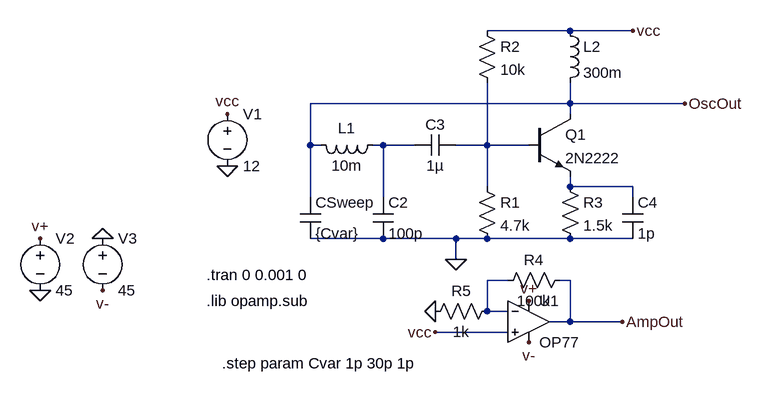
[diagram p0: schematic ColpittsOscilator2.asc]
ColpittsOscilator2.asc, the LTspice schematic file:
Version 4
SHEET 1 1280 784
WIRE 432 -32 304 -32
WIRE 528 -32 432 -32
WIRE 432 80 432 48
WIRE 432 80 32 80
WIRE 608 80 432 80
WIRE 432 96 432 80
WIRE 32 144 32 80
WIRE 48 144 32 144
WIRE 144 144 128 144
WIRE 192 144 144 144
WIRE 304 144 304 48
WIRE 304 144 256 144
WIRE 368 144 304 144
WIRE 304 208 304 144
WIRE 432 208 432 192
WIRE 528 208 432 208
WIRE 32 224 32 144
WIRE 144 224 144 144
WIRE 528 224 528 208
WIRE 144 288 32 288
WIRE 256 288 144 288
WIRE 304 288 256 288
WIRE 432 288 304 288
WIRE 528 288 432 288
WIRE 256 320 256 288
WIRE 336 352 304 352
WIRE 432 352 416 352
WIRE 304 400 304 352
WIRE 336 400 304 400
WIRE 432 416 432 352
WIRE 432 416 400 416
WIRE 512 416 432 416
WIRE 336 432 224 432
FLAG -96 176 0
FLAG -96 96 vcc
FLAG 256 320 0
FLAG 528 -32 vcc
FLAG 608 80 OscOut
FLAG 512 416 AmpOut
FLAG -384 368 0
FLAG -384 288 v+
FLAG 368 384 v+
FLAG -288 288 0
FLAG -288 368 v-
FLAG 368 448 v-
FLAG 224 400 0
FLAG 224 432 vcc
SYMBOL voltage -96 80 R0
WINDOW 123 0 0 Left 0
WINDOW 39 0 0 Left 0
SYMATTR InstName V1
SYMATTR Value 12
SYMBOL cap 16 224 R0
SYMATTR InstName CSweep
SYMATTR Value {Cvar}
SYMBOL cap 128 224 R0
SYMATTR InstName C2
SYMATTR Value 100p
SYMBOL res 288 192 R0
SYMATTR InstName R1
SYMATTR Value 4.7k
SYMBOL res 288 -48 R0
SYMATTR InstName R2
SYMATTR Value 10k
SYMBOL ind 416 -48 R0
SYMATTR InstName L2
SYMATTR Value 300m
SYMBOL res 416 192 R0
SYMATTR InstName R3
SYMATTR Value 1.5k
SYMBOL cap 256 128 R90
WINDOW 0 0 32 VBottom 2
WINDOW 3 32 32 VTop 2
SYMATTR InstName C3
SYMATTR Value 1µ
SYMBOL ind 144 128 R90
WINDOW 0 5 56 VBottom 2
WINDOW 3 32 56 VTop 2
SYMATTR InstName L1
SYMATTR Value 10m
SYMBOL cap 512 224 R0
SYMATTR InstName C4
SYMATTR Value 1p
SYMBOL voltage -384 272 R0
WINDOW 123 0 0 Left 0
WINDOW 39 0 0 Left 0
SYMATTR InstName V2
SYMATTR Value 45
SYMBOL voltage -288 272 R0
WINDOW 123 0 0 Left 0
WINDOW 39 0 0 Left 0
SYMATTR InstName V3
SYMATTR Value 45
SYMBOL OpAmps\\OP77 368 352 R0
SYMATTR InstName U1
SYMBOL res 432 336 R90
WINDOW 0 0 56 VBottom 2
WINDOW 3 32 56 VTop 2
SYMATTR InstName R4
SYMATTR Value 100k
SYMBOL res 320 384 R90
WINDOW 0 0 56 VBottom 2
WINDOW 3 32 56 VTop 2
SYMATTR InstName R5
SYMATTR Value 1k
SYMBOL npn 368 96 R0
SYMATTR InstName Q1
SYMATTR Value 2N2222
TEXT -128 344 Left 2 !.tran 0 0.001 0
TEXT -128 384 Left 2 !.lib opamp.sub
TEXT -104 480 Left 2 !.step param Cvar 1p 30p 1p

The netlist it stands for:
* ColpittsOscilator2.asc
V1 vcc 0 12
CSweep OscOut 0 {Cvar}
C2 N001 0 100p
R1 N002 0 4.7k
R2 vcc N002 10k
L2 vcc OscOut 300m
R3 N003 0 1.5k
C3 N002 N001 1µ
L1 N001 OscOut 10m
C4 N003 0 1p
V2 v+ 0 45
V3 0 v- 45
XU1 vcc N004 v+ v- AmpOut OP77  ; pins In+ In- V+ V- OUT
R4 AmpOut N004 100k
R5 N004 0 1k
Q1 OscOut N002 N003 0 2N2222
.model NPN NPN
.model PNP PNP
.lib standard.bjt
.tran 0 0.001 0
.lib opamp.sub
.step param Cvar 1p 30p 1p
.lib ADI.lib
.backanno
.end